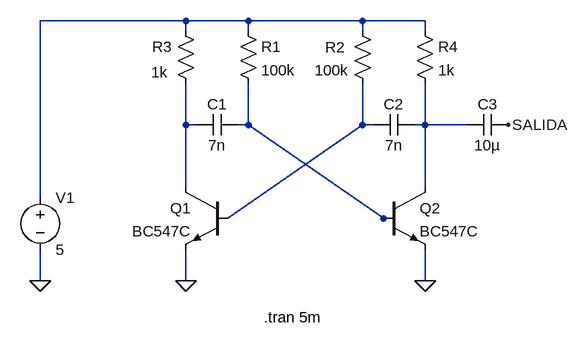
[diagram p0: schematic transistor-multivibrador.asc]
transistor-multivibrador.asc, the LTspice schematic file:
Version 4
SHEET 1 880 680
WIRE 16 -720 -208 -720
WIRE 112 -720 16 -720
WIRE 288 -720 112 -720
WIRE 384 -720 288 -720
WIRE 16 -704 16 -720
WIRE 112 -704 112 -720
WIRE 288 -704 288 -720
WIRE 384 -704 384 -720
WIRE 16 -560 16 -624
WIRE 32 -560 16 -560
WIRE 112 -560 112 -624
WIRE 112 -560 96 -560
WIRE 288 -560 288 -624
WIRE 304 -560 288 -560
WIRE 384 -560 384 -624
WIRE 384 -560 368 -560
WIRE 448 -560 384 -560
WIRE 16 -464 16 -560
WIRE 384 -464 384 -560
WIRE -208 -448 -208 -720
WIRE 80 -416 288 -560
WIRE 320 -416 112 -560
WIRE 336 -416 320 -416
WIRE -208 -320 -208 -368
WIRE 16 -320 16 -368
WIRE 384 -320 384 -368
FLAG 16 -320 0
FLAG -208 -320 0
FLAG 384 -320 0
FLAG 512 -560 SALIDA
SYMBOL npn 320 -464 R0
SYMATTR InstName Q2
SYMATTR Value BC547C
SYMBOL res 368 -720 R0
SYMATTR InstName R4
SYMATTR Value 1k
SYMBOL res 0 -720 R0
WINDOW 0 -36 40 Left 2
WINDOW 3 -37 79 Left 2
SYMATTR InstName R3
SYMATTR Value 1k
SYMBOL res 96 -720 R0
SYMATTR InstName R1
SYMATTR Value 100k
SYMBOL res 272 -720 R0
WINDOW 0 -42 41 Left 2
WINDOW 3 -58 76 Left 2
SYMATTR InstName R2
SYMATTR Value 100k
SYMBOL cap 96 -576 R90
WINDOW 0 0 32 VBottom 2
WINDOW 3 32 32 VTop 2
SYMATTR InstName C1
SYMATTR Value 7n
SYMBOL cap 368 -576 R90
WINDOW 0 0 32 VBottom 2
WINDOW 3 32 32 VTop 2
SYMATTR InstName C2
SYMATTR Value 7n
SYMBOL voltage -208 -464 R0
WINDOW 123 0 0 Left 0
WINDOW 39 0 0 Left 0
SYMATTR InstName V1
SYMATTR Value 5
SYMBOL npn 80 -464 M0
SYMATTR InstName Q1
SYMATTR Value BC547C
SYMBOL cap 512 -576 R90
WINDOW 0 0 32 VBottom 2
WINDOW 3 32 32 VTop 2
SYMATTR InstName C3
SYMATTR Value 10µ
TEXT 136 -264 Left 2 !.tran 5m

The netlist it stands for:
* transistor-multivibrador.asc
Q2 N005 N003 0 0 BC547C
R4 N001 N005 1k
R3 N001 N002 1k
R1 N001 N003 100k
R2 N001 N004 100k
C1 N003 N002 7n
C2 N005 N004 7n
V1 N001 0 5
Q1 N002 N004 0 0 BC547C
C3 SALIDA N005 10µ
.model NPN NPN
.model PNP PNP
.lib standard.bjt
.tran 5m
.backanno
.end